# Altium schematic sheet 11 EXPANSION CN.SchDoc
size A3; Organization: Protel International P/L; Address1: L3, 12a Rodborough Rd; Address2: Frenchs Forest; Address3: NSW; Address4: Australia 2086; SPICEModelCacheQOLTSZGZ: <root> / <DocumentId>QOLTSZGZ</DocumentId> / </root>
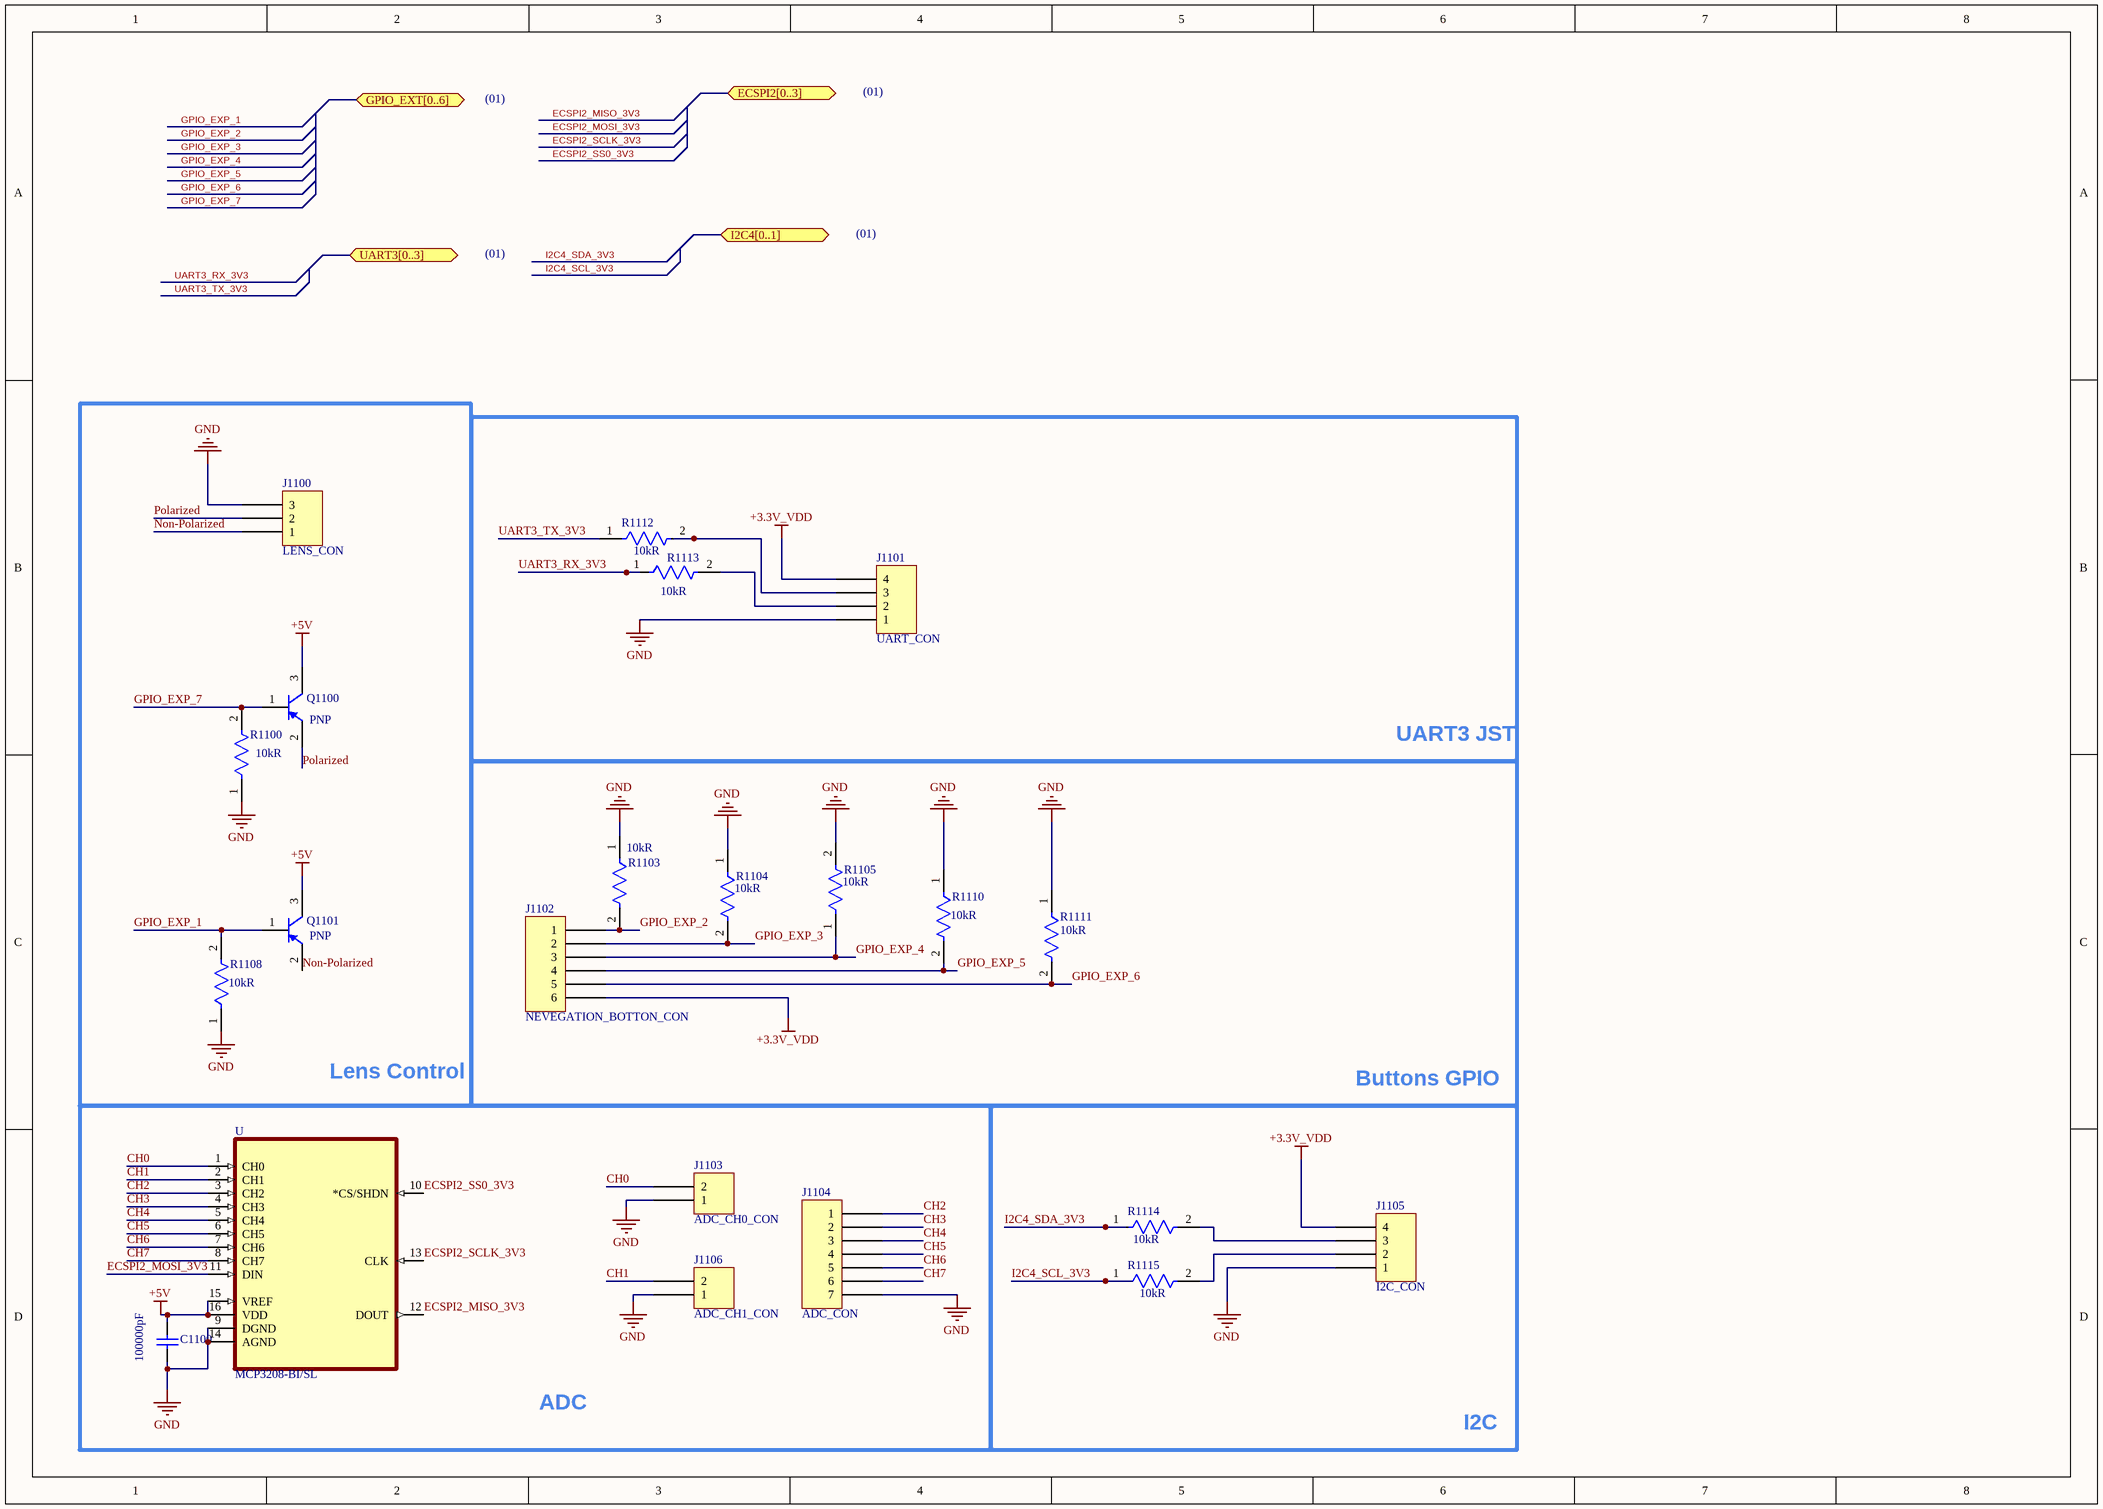
[diagram p0: 11 EXPANSION CN.SchDoc]

## Parts
C1100  Capacitance: 100000pF  [CAPC1050X55X23ML05T13]  (hidden comment: CL05B104KO5NNNC)
J1100  LENS_CON  [HIROSE DF13-3P-1.25H]
J1101  UART_CON  [HIROSE DF13A-4P-1.25H]
J1102  NEVEGATION_BOTTON_CON  [HIROSE DF13A-6P-1.25H]
J1103  ADC_CH0_CON  [HIROSE DF13-2P-1.25H]
J1104  ADC_CON  [JST SM07B-SRSS-TB]
J1105  I2C_CON  [HIROSE DF13A-4P-1.25H]
J1106  ADC_CH1_CON  [HIROSE DF13-2P-1.25H]
Q1100  Polarity: PNP  [ONSC-SOT-23-3-318-08_V]  (hidden comment: BC807-40LT1G)
Q1101  Polarity: PNP  [ONSC-SOT-23-3-318-08_V]  (hidden comment: BC807-40LT1G)
R1100  Resistance: 10kR  [FP-RMCF0603-IPC_C]  (hidden comment: RMCF0603JT10K0)
R1103  Resistance: 10kR  [FP-RMCF0603-IPC_C]  (hidden comment: RMCF0603JT10K0)
R1104  Resistance: 10kR  [FP-RMCF0603-IPC_C]  (hidden comment: RMCF0603JT10K0)
R1105  Resistance: 10kR  [FP-RMCF0603-IPC_C]  (hidden comment: RMCF0603JT10K0)
R1108  Resistance: 10kR  [FP-RMCF0603-IPC_C]  (hidden comment: RMCF0603JT10K0)
R1110  Resistance: 10kR  [FP-RMCF0603-IPC_C]  (hidden comment: RMCF0603JT10K0)
R1111  Resistance: 10kR  [FP-RMCF0603-IPC_C]  (hidden comment: RMCF0603JT10K0)
R1112  Resistance: 10kR  [FP-RMCF0603-IPC_C]  (hidden comment: RMCF0603JT10K0)
R1113  Resistance: 10kR  [FP-RMCF0603-IPC_C]  (hidden comment: RMCF0603JT10K0)
R1114  Resistance: 10kR  [FP-RMCF0603-IPC_C]  (hidden comment: RMCF0603JT10K0)
R1115  Resistance: 10kR  [FP-RMCF0603-IPC_C]  (hidden comment: RMCF0603JT10K0)
U  MCP3208-BI/SL  [SOIC127P600X175-16N]

## Blocks framed on the sheet
Lens Control: J1100 Q1100 Q1101 R1100 R1108
UART3 JST: J1101 R1112 R1113
ADC: C1100 J1103 J1104 J1106 U

## Ports
ECSPI2[0..3] (bidir), GPIO_EXT[0..6] (bidir), I2C4[0..1] (bidir), UART3[0..3] (bidir)

## Nets
+3.3V_VDD: J1101.4 J1102.6 J1105.4
+5V: C1100.2 Q1100.3(C) Q1101.3(C) U.15(VREF) U.16(VDD)
GND: C1100.1 J1100.3 J1101.1 J1103.1 J1104.7 J1105.1 J1106.1 R1100.1 R1103.1 R1104.1 R1105.2 R1108.1 R1110.1 R1111.1 U.9(DGND) U.14(AGND)
CH0: J1103.2 U.1(CH0)
CH1: J1106.2 U.2(CH1)
CH2: J1104.1 U.3(CH2)
CH3: J1104.2 U.4(CH3)
CH4: J1104.3 U.5(CH4)
CH5: J1104.4 U.6(CH5)
CH6: J1104.5 U.7(CH6)
CH7: J1104.6 U.8(CH7)
ECSPI2_MISO_3V3: U.12(DOUT)
ECSPI2_MOSI_3V3: U.11(DIN)
ECSPI2_SCLK_3V3: U.13(CLK)
ECSPI2_SS0_3V3: U.10(*CS/SHDN)
GPIO_EXP_1: Q1101.1(B) R1108.2
GPIO_EXP_2: J1102.1 R1103.2
GPIO_EXP_3: J1102.2 R1104.2
GPIO_EXP_4: J1102.3 R1105.1
GPIO_EXP_5: J1102.4 R1110.2
GPIO_EXP_6: J1102.5 R1111.2
GPIO_EXP_7: Q1100.1(B) R1100.2
I2C4_SCL_3V3: R1115.1
I2C4_SDA_3V3: R1114.1
Non-Polarized: J1100.1 Q1101.2(E)
Polarized: J1100.2 Q1100.2(E)
UART3_RX_3V3: R1113.1
UART3_TX_3V3: R1112.1
NetJ1101_2: J1101.2 R1113.2
NetJ1101_3: J1101.3 R1112.2
NetJ1105_2: J1105.2 R1115.2
NetJ1105_3: J1105.3 R1114.2

## Notes on the sheet
- (01)
- Buttons GPIO
- I2C
- Sheet Title:
- Inventron
- Size:
- Drawn By:
- Revision:
- Project:
- Checked By:
- A4
- Sheet
- of
- Budotek Teknopark
- Dudullu OSB
- Des 2. Cadde No:8/30
- Umraniye / ISTANBUL
- Electronics and Software
- Date:
- Time:
- ©2020 Inventron Electronics and Software. All rights reserved.

## Library data of the parts
C1100 = CMP-2000-05439-1: Chip Capacitor, 100 nF, +/- 10%, 16 V, -55 to 125 degC, 0402 (1005 Metric), RoHS, Tape and Reel; Manufacturer-1: Samsung Electro-Mechanics; Dielectric: X7R; Rated Voltage: 16V; Case Size/Dimension: 0402; Tolerance (%): ±10%; Manufacturer URL: http://www.samsungsem.com/global/index.jsp; Datasheet URL: https://datasheet.ciiva.com/29198/458718-da-01-en-vs-kondensator-0402-29198423.pdf; Datasheet Version: Nov-10; Manufacturer Part Number-1: CL05B104KO5NNNC; Class: Capacitor
J1100 = DF13-3P-1.25H(75): CONN HEADER SMD R/A 3POS 1.25MM; Manufacturer: Hirose Electric Co Ltd; Current Rating (Amps): 1A; Material Flammability Rating: UL94 V-0; Number of Positions: 3; Number of Positions Loaded: All; Pitch - Mating: 0.049" (1.25mm); Shrouding: Shrouded - 4 Wall; Style: Board to Cable/Wire; Voltage Rating: 150V; Part Number: DF13-3P-1.25H(75); ComponentLink1Description: Datasheet; ComponentLink1URL: https://www.hirose.com/product/document?clcode=CL0536-0109-0-76&productname=DF13-10P-1.25DSA(76)&series=DF13&documenttype=Catalog&lang=en&documentid=D31687_en; ComponentLink2Description: DigiKey Link; ComponentLink2URL: //digikey.com/product-detail/en/hirose-electric-co-ltd/DF13-3P-1.25H-75/H126394-ND/9170627; Connector Type: Header; Contact Finish - Mating: Tin; Contact Finish - Post: Tin; Contact Finish Thickness - Mating: 39.4µin (1.00µm); Contact Material: Brass; Contact Shape: Square; Contact Type: Male Pin; Fastening Type: Detent Lock; Features: Board Guide, Solder Retention; Insulation Color: Beige; Insulation Height: 0.142" (3.60mm); Insulation Material: Polyamide (PA), Nylon; LastUpdated: 12/16/2019 7:22:47 PM; Lifecycle Status: 0; Minimum Order: 1; Mounting Type: Surface Mount, Right Angle; Number of Rows: 1; Operating Temperature: -35°C ~ 85°C; Packaging: Tube; PartId: 2; Part Status: Active; Price: 0.41; Series: DF13; Supplier 1: DigiKey; Supplier Part Number 1: H126394-ND; Termination: Solder
J1101 J1105 = DF13A-4P-1.25H(75): CONN HEADER SMD R/A 4POS 1.25MM; Manufacturer: Hirose Electric Co Ltd; Current Rating (Amps): 1A; Material Flammability Rating: UL94 V-0; Number of Positions: 4; Number of Positions Loaded: All; Pitch - Mating: 0.049" (1.25mm); Shrouding: Shrouded - 4 Wall; Style: Board to Cable/Wire; Voltage Rating: 150V; Part Number: DF13A-4P-1.25H(75); ComponentLink1Description: Datasheet; ComponentLink1URL: https://www.hirose.com/product/download/?distributor=digikey&type=specSheet&lang=en&num=DF13A-4P-1.25H(75); ComponentLink2Description: DigiKey Link; ComponentLink2URL: //digikey.com/product-detail/en/hirose-electric-co-ltd/DF13A-4P-1.25H-75/H126438-ND/9170678; Connector Type: Header; Contact Finish - Mating: Tin; Contact Finish - Post: Tin; Contact Finish Thickness - Mating: 39.4µin (1.00µm); Contact Material: Brass; Contact Shape: Square; Contact Type: Male Pin; Fastening Type: Detent Lock; Features: Solder Retention; Insulation Color: Beige; Insulation Height: 0.142" (3.60mm); Insulation Material: Polyamide (PA), Nylon; LastUpdated: 12/16/2019 7:34:28 PM; Lifecycle Status: 0; Minimum Order: 1; Mounting Type: Surface Mount, Right Angle; Number of Rows: 1; Operating Temperature: -35°C ~ 85°C; Packaging: Tube; PartId: 8; Part Status: Active; Price: 0.45; Series: DF13; Supplier 1: DigiKey; Supplier Part Number 1: H126438-ND; Termination: Solder
J1102 = DF13A-6P-1.25H(75): CONN HEADER SMD R/A 6POS 1.25MM; Manufacturer: Hirose Electric Co Ltd; Current Rating (Amps): 1A; Material Flammability Rating: UL94 V-0; Number of Positions: 6; Number of Positions Loaded: All; Pitch - Mating: 0.049" (1.25mm); Shrouding: Shrouded - 4 Wall; Style: Board to Cable/Wire; Voltage Rating: 150V; Part Number: DF13A-6P-1.25H(75); ComponentLink1Description: Datasheet; ComponentLink1URL: https://www.hirose.com/product/document?clcode=CL0536-0109-0-76&productname=DF13-10P-1.25DSA(76)&series=DF13&documenttype=Catalog&lang=en&documentid=D31687_en; ComponentLink2Description: DigiKey Link; ComponentLink2URL: http://digikey.com/product-detail/en/hirose-electric-co-ltd/DF13A-6P-1.25H-75/H126442-ND/9170682; Connector Type: Header; Contact Finish - Mating: Tin; Contact Finish - Post: Tin; Contact Finish Thickness - Mating: 39.4µin (1.00µm); Contact Material: Brass; Contact Shape: Square; Contact Type: Male Pin; Fastening Type: Detent Lock; Features: Solder Retention; Insulation Color: Beige; Insulation Height: 0.142" (3.60mm); Insulation Material: Polyamide (PA), Nylon; LastUpdated: 1/15/2020 3:36:45 AM; Lifecycle Status: Active; Minimum Order: 1; Mounting Type: Surface Mount, Right Angle; Number of Rows: 1; Operating Temperature: -35°C ~ 85°C; Packaging: Tube; PartId: 10; Part Status: Active; Price: 0.51; Series: DF13; Supplier 1: DigiKey; Supplier Part Number 1: H126442-ND; Termination: Solder
J1103 J1106 = DF13-2P-1.25H(75): CONN HEADER SMD R/A 2POS 1.25MM; Manufacturer: Hirose Electric Co Ltd; Current Rating (Amps): 1A; Material Flammability Rating: UL94 V-0; Number of Positions: 2; Number of Positions Loaded: All; Pitch - Mating: 0.049" (1.25mm); Shrouding: Shrouded - 4 Wall; Style: Board to Cable/Wire; Voltage Rating: 150V; Part Number: DF13-2P-1.25H(75); ComponentLink1Description: Datasheet; ComponentLink1URL: https://www.hirose.com/product/document?clcode=CL0536-0109-0-76&productname=DF13-10P-1.25DSA(76)&series=DF13&documenttype=Catalog&lang=en&documentid=D31687_en; ComponentLink2Description: DigiKey Link; ComponentLink2URL: //digikey.com/product-detail/en/hirose-electric-co-ltd/DF13-2P-1.25H-75/H126389-ND/9170621; Connector Type: Header; Contact Finish - Mating: Tin; Contact Finish - Post: Tin; Contact Finish Thickness - Mating: 39.4µin (1.00µm); Contact Material: Brass; Contact Shape: Square; Contact Type: Male Pin; Fastening Type: Detent Lock; Features: Board Guide, Solder Retention; Insulation Color: Beige; Insulation Height: 0.142" (3.60mm); Insulation Material: Polyamide (PA), Nylon; LastUpdated: 12/16/2019 7:22:19 PM; Lifecycle Status: 0; Minimum Order: 1; Mounting Type: Surface Mount, Right Angle; Number of Rows: 1; Operating Temperature: -35°C ~ 85°C; Packaging: Tube; PartId: 1; Part Status: Active; Price: 0.37; Series: DF13; Supplier 1: DigiKey; Supplier Part Number 1: H126389-ND; Termination: Solder
J1104 = SM07B-SRSS-TB(LF)(SN): CONN HEADER SMD R/A 7POS 1MM; Manufacturer: JST Sales America Inc.; Current Rating (Amps): 0.7A; Material Flammability Rating: UL94 V-0; Number of Positions: 7; Number of Positions Loaded: All; Pitch - Mating: 0.039" (1.00mm); Shrouding: Shrouded - 4 Wall; Style: Board to Cable/Wire; Voltage Rating: 50V; Part Number: SM07B-SRSS-TB(LF)(SN); ComponentLink1Description: Datasheet; ComponentLink1URL: http://www.jst-mfg.com/product/pdf/eng/eSH.pdf; ComponentLink2Description: DigiKey Link; ComponentLink2URL: http://digikey.com/product-detail/en/jst-sales-america-inc/SM07B-SRSS-TB-LF-SN/455-1807-1-ND/926878; Connector Type: Header; Contact Finish - Mating: Tin; Contact Finish - Post: Tin; Contact Material: Copper Alloy; Contact Shape: Square; Contact Type: Male Pin; Fastening Type: Push-Pull; Features: Solder Retention; Insulation Color: Natural; Insulation Height: 0.114" (2.90mm); Insulation Material: Polyamide (PA), Nylon; LastUpdated: 1/12/2020 11:42:26 PM; Lifecycle Status: Active; Minimum Order: 1; Mounting Type: Surface Mount, Right Angle; Number of Rows: 1; Operating Temperature: -25°C ~ 85°C; Packaging: TapeAndReel; PartId: 65; Part Status: Active; Price: 0.39; Series: SR; Supplier 1: DigiKey; Supplier Part Number 1: 455-1807-1-ND; Termination: Solder
Q1100 Q1101 = CMP-1048-00745-1: General Purpose Transistor, PNP Silicon, 3-Pin SOT-23, Pb-Free, Tape and Reel; Manufacturer-1: On Semiconductor; fT Min (MHz): 100; IC Continuous (A): -0.5; Mounting Technology: Surface Mount; ComponentLink3URL: http://www.onsemi.cn/pub_link/Collateral/318-08.PDF; Manufacturer Part Number-1: BC807-40LT1G; DatasheetVersion: Rev. 10; RoHS: TRUE; ComponentLink1URL: http://www.onsemi.com/; ComponentLink2URL: http://www.onsemi.com/pub_link/Collateral/BC807-16LT1-D.PDF; ComponentLink1Description: Manufacturer URL; ComponentLink3Description: Package Specification; PackageVersion: Rev. AP, 11/2009; PackageReference: SOT-23-3-318-08; PackageDescription: 3-Pin Small Outline Transistor, Body 2.92 x 1.3 mm, Pitch 0.95 mm; Packing: Tape and Reel; ComponentLink2Description: Datasheet; Class: Transistor
R1100 R1103-R1105 R1108 R1110-R1115 = CMP-26527-002098-1: 10kΩ ±5% 0.1W 0603 Thick Film Chip Resistor AEC-Q200 compliant; Manufacturer-1: Stackpole Electronics Inc; Power Rating: 100mW; Temperature Coefficient: 100ppm/°C; Radiation Hardening: No; Military Standard: Not; Mount: Surface Mount; Resistor Type: Thick Film; Size Code: 0603; Case/Package: 0603; Min Operating Temperature: -55°C; Construction: Rectangular; Series: RMCF; Width: 0.031inch; Length: 1.55mm; Case Code (Metric): 1608; Depth: 0.8mm; Height: 0.022inch; Packaging: Tape and Reel; Lead Free: Lead Free; Tolerance: 5%; Case Code (Imperial): 0603; Max Operating Temperature: 155°C; Contact Plating: Tin; Max Power Dissipation: 100mW; Features: Automotive AEC-Q200; Number of Terminations: 2; Manufacturer Part Number-1: RMCF0603JT10K0; Class: Resistor
U = MCP3208-BI/SL: 12 Bit Analog to Digital Converter 4, 8 Input 1 SAR 16-SOIC; Manufacturer-1: Microchip; Class: ICs; Value: *; Manufacturer Part Number-1: MCP3208-BI/SL; Package: SOIC-16 Microchip; Availability: Unavailable; SnapEDA_Link: https://www.snapeda.com/parts/MCP3208-BI/SL/Microchip/view-part/1037416/?ref=snap; Price: None